# Altium schematic sheet 10.LPDDR4.SchDoc
size A3; SheetNumber: 10; SheetTotal: 10
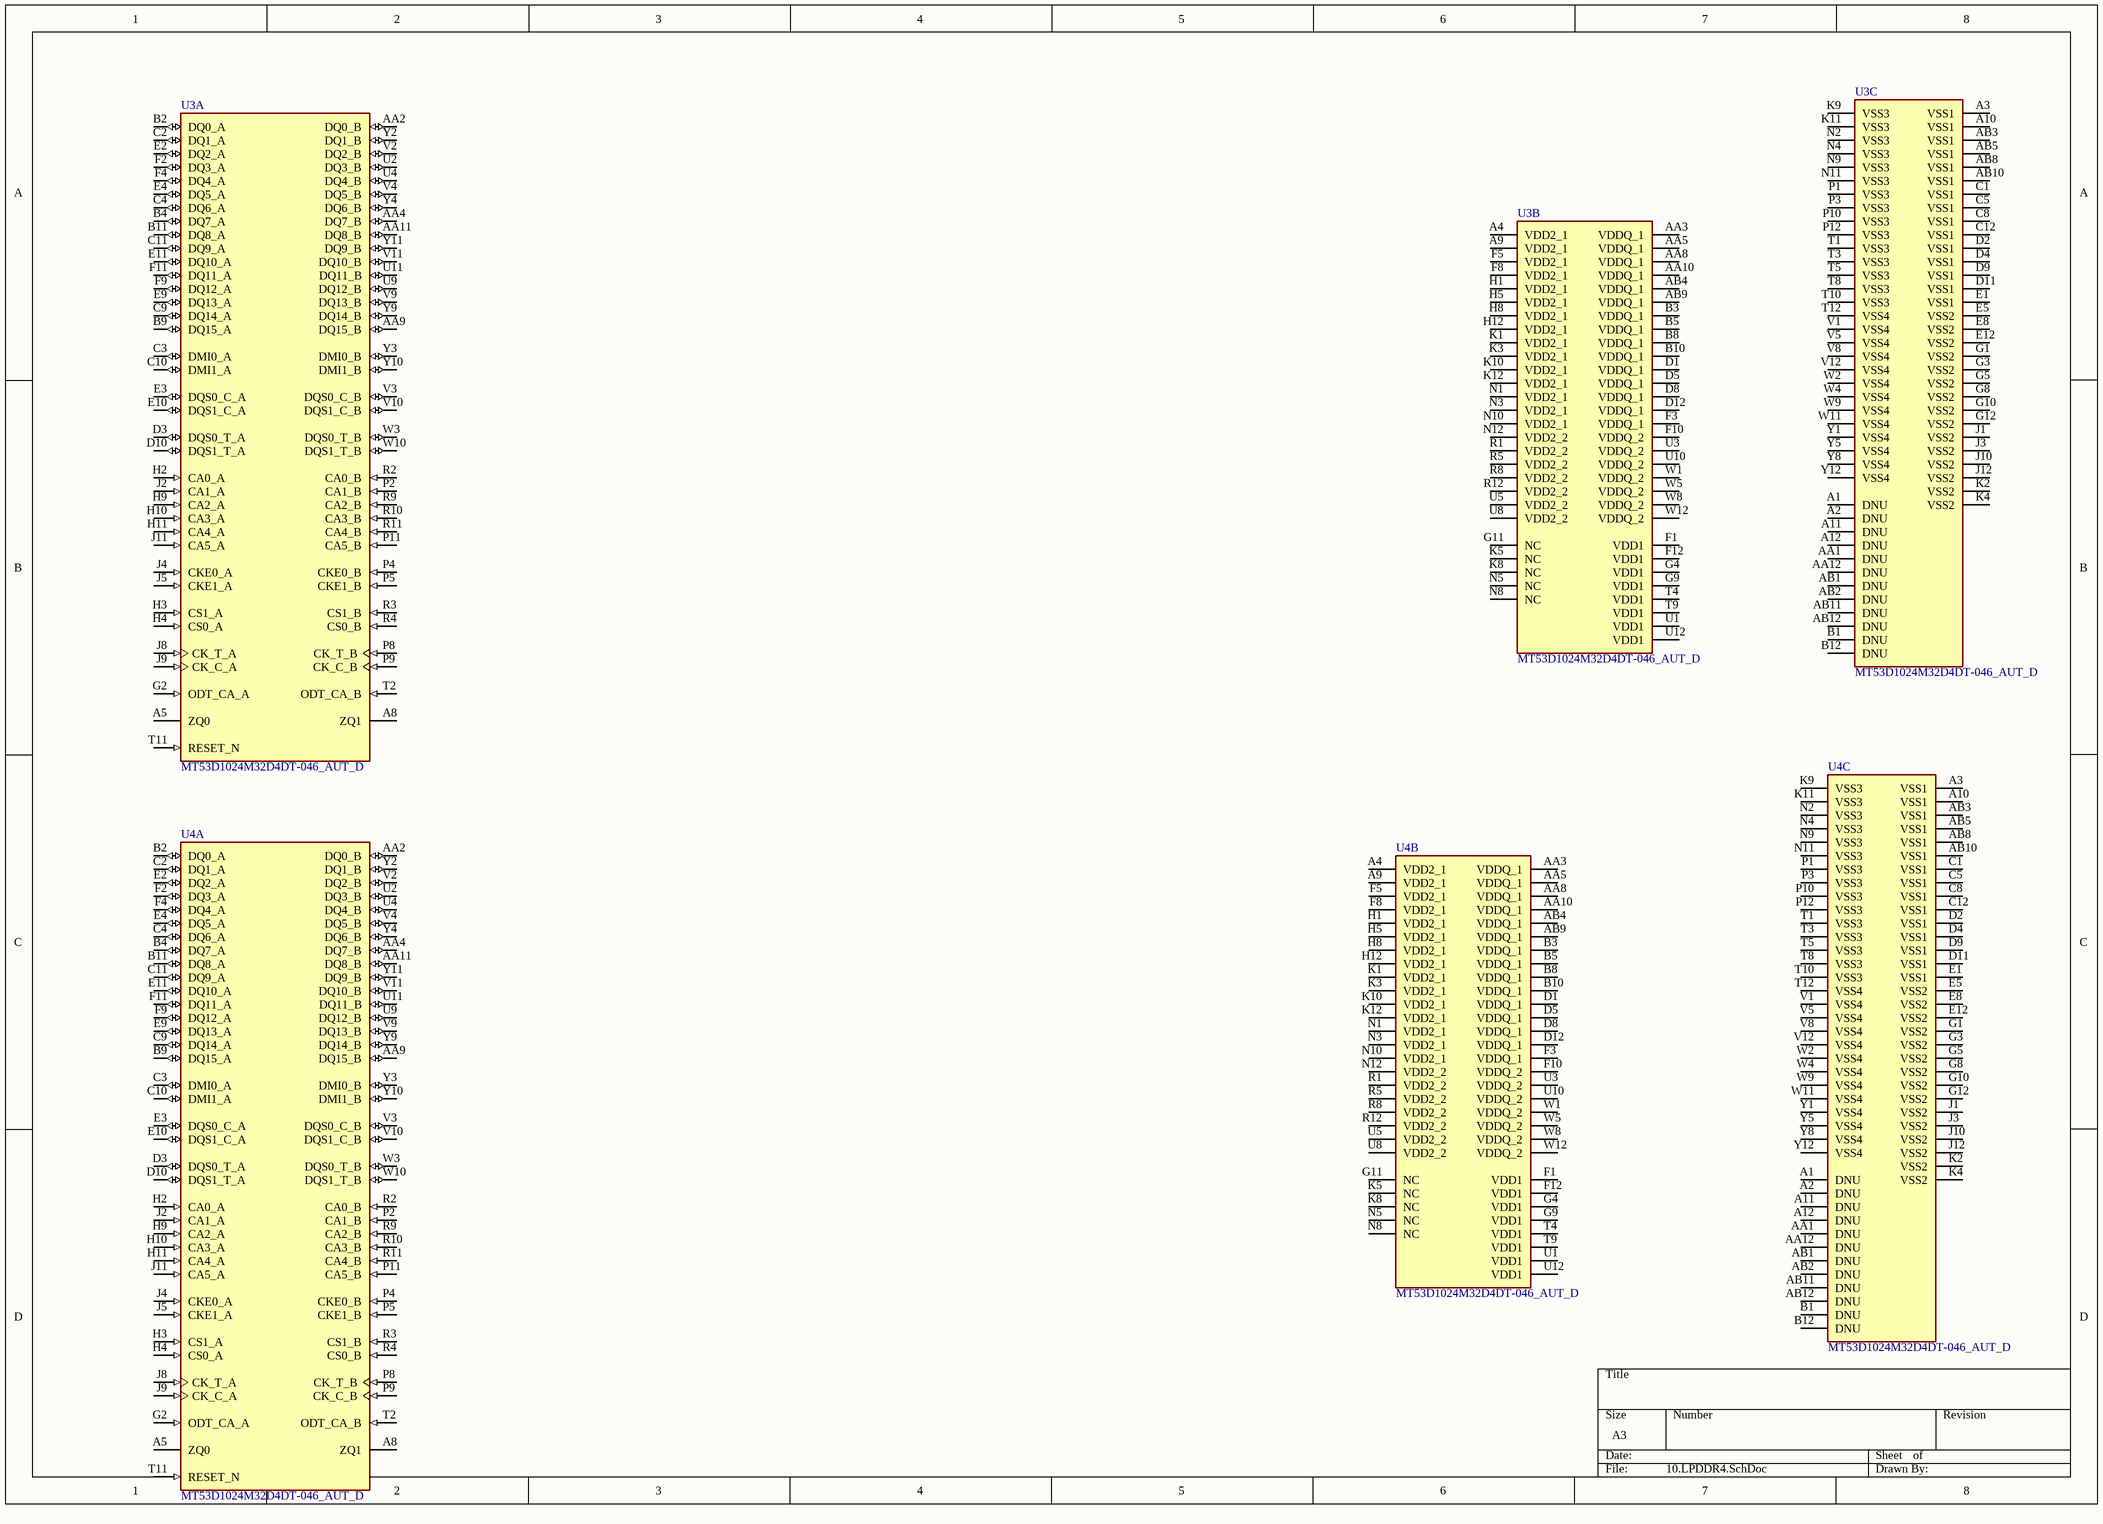
[diagram p0: 10.LPDDR4.SchDoc]

## Parts
U3  MT53D1024M32D4DT-046_AUT_D  [IC_MT53D1024M32D4DT-046_AUT_D]  (parts A,B,C of 3)
U4  MT53D1024M32D4DT-046_AUT_D  [IC_MT53D1024M32D4DT-046_AUT_D]  (parts A,B,C of 3)

## Nets

Not connected (* = marked no-connect by the designer): U3 A1(DNU) A2(DNU) A3(VSS1) A4(VDD2_1) A5(ZQ0) A8(ZQ1) A9(VDD2_1) A10(VSS1) A11(DNU) A12(DNU) AA1(DNU) AA2(DQ0_B) AA3(VDDQ_1) AA4(DQ7_B) AA5(VDDQ_1) AA8(VDDQ_1) AA9(DQ15_B) AA10(VDDQ_1) AA11(DQ8_B) AA12(DNU) AB1(DNU) AB2(DNU) AB3(VSS1) AB4(VDDQ_1) AB5(VSS1) AB8(VSS1) AB9(VDDQ_1) AB10(VSS1) AB11(DNU) AB12(DNU) B1(DNU) B2(DQ0_A) B3(VDDQ_1) B4(DQ7_A) B5(VDDQ_1) B8(VDDQ_1) B9(DQ15_A) B10(VDDQ_1) B11(DQ8_A) B12(DNU) C1(VSS1) C2(DQ1_A) C3(DMI0_A) C4(DQ6_A) C5(VSS1) C8(VSS1) C9(DQ14_A) C10(DMI1_A) C11(DQ9_A) C12(VSS1) D1(VDDQ_1) D2(VSS1) D3(DQS0_T_A) D4(VSS1) D5(VDDQ_1) D8(VDDQ_1) D9(VSS1) D10(DQS1_T_A) D11(VSS1) D12(VDDQ_1) E1(VSS1) E2(DQ2_A) E3(DQS0_C_A) E4(DQ5_A) E5(VSS2) E8(VSS2) E9(DQ13_A) E10(DQS1_C_A) E11(DQ10_A) E12(VSS2) F1(VDD1) F2(DQ3_A) F3(VDDQ_1) F4(DQ4_A) F5(VDD2_1) F8(VDD2_1) F9(DQ12_A) F10(VDDQ_2) F11(DQ11_A) F12(VDD1) G1(VSS2) G2(ODT_CA_A) G3(VSS2) G4(VDD1) G5(VSS2) G8(VSS2) G9(VDD1) G10(VSS2) G11(NC) G12(VSS2) H1(VDD2_1) H2(CA0_A) H3(CS1_A) H4(CS0_A) H5(VDD2_1) H8(VDD2_1) H9(CA2_A) H10(CA3_A) H11(CA4_A) H12(VDD2_1) J1(VSS2) J2(CA1_A) J3(VSS2) J4(CKE0_A) J5(CKE1_A) J8(CK_T_A) J9(CK_C_A) J10(VSS2) J11(CA5_A) J12(VSS2) K1(VDD2_1) K2(VSS2) K3(VDD2_1) K4(VSS2) K5(NC) K8(NC) K9(VSS3) K10(VDD2_1) K11(VSS3) K12(VDD2_1) N1(VDD2_1) N2(VSS3) N3(VDD2_1) N4(VSS3) N5(NC) N8(NC) N9(VSS3) N10(VDD2_1) N11(VSS3) N12(VDD2_2) P1(VSS3) P2(CA1_B) P3(VSS3) P4(CKE0_B) P5(CKE1_B) P8(CK_T_B) P9(CK_C_B) P10(VSS3) P11(CA5_B) P12(VSS3) R1(VDD2_2) R2(CA0_B) R3(CS1_B) R4(CS0_B) R5(VDD2_2) R8(VDD2_2) R9(CA2_B) R10(CA3_B) R11(CA4_B) R12(VDD2_2) T1(VSS3) T2(ODT_CA_B) T3(VSS3) T4(VDD1) T5(VSS3) T8(VSS3) T9(VDD1) T10(VSS3) T11(RESET_N) T12(VSS4) U1(VDD1) U2(DQ3_B) U3(VDDQ_2) U4(DQ4_B) U5(VDD2_2) U8(VDD2_2) U9(DQ12_B) U10(VDDQ_2) U11(DQ11_B) U12(VDD1) V1(VSS4) V2(DQ2_B) V3(DQS0_C_B) V4(DQ5_B) V5(VSS4) V8(VSS4) V9(DQ13_B) V10(DQS1_C_B) V11(DQ10_B) V12(VSS4) W1(VDDQ_2) W2(VSS4) W3(DQS0_T_B) W4(VSS4) W5(VDDQ_2) W8(VDDQ_2) W9(VSS4) W10(DQS1_T_B) W11(VSS4) W12(VDDQ_2) Y1(VSS4) Y2(DQ1_B) Y3(DMI0_B) Y4(DQ6_B) Y5(VSS4) Y8(VSS4) Y9(DQ14_B) Y10(DMI1_B) Y11(DQ9_B) Y12(VSS4); U4 A1(DNU) A2(DNU) A3(VSS1) A4(VDD2_1) A5(ZQ0) A8(ZQ1) A9(VDD2_1) A10(VSS1) A11(DNU) A12(DNU) AA1(DNU) AA2(DQ0_B) AA3(VDDQ_1) AA4(DQ7_B) AA5(VDDQ_1) AA8(VDDQ_1) AA9(DQ15_B) AA10(VDDQ_1) AA11(DQ8_B) AA12(DNU) AB1(DNU) AB2(DNU) AB3(VSS1) AB4(VDDQ_1) AB5(VSS1) AB8(VSS1) AB9(VDDQ_1) AB10(VSS1) AB11(DNU) AB12(DNU) B1(DNU) B2(DQ0_A) B3(VDDQ_1) B4(DQ7_A) B5(VDDQ_1) B8(VDDQ_1) B9(DQ15_A) B10(VDDQ_1) B11(DQ8_A) B12(DNU) C1(VSS1) C2(DQ1_A) C3(DMI0_A) C4(DQ6_A) C5(VSS1) C8(VSS1) C9(DQ14_A) C10(DMI1_A) C11(DQ9_A) C12(VSS1) D1(VDDQ_1) D2(VSS1) D3(DQS0_T_A) D4(VSS1) D5(VDDQ_1) D8(VDDQ_1) D9(VSS1) D10(DQS1_T_A) D11(VSS1) D12(VDDQ_1) E1(VSS1) E2(DQ2_A) E3(DQS0_C_A) E4(DQ5_A) E5(VSS2) E8(VSS2) E9(DQ13_A) E10(DQS1_C_A) E11(DQ10_A) E12(VSS2) F1(VDD1) F2(DQ3_A) F3(VDDQ_1) F4(DQ4_A) F5(VDD2_1) F8(VDD2_1) F9(DQ12_A) F10(VDDQ_2) F11(DQ11_A) F12(VDD1) G1(VSS2) G2(ODT_CA_A) G3(VSS2) G4(VDD1) G5(VSS2) G8(VSS2) G9(VDD1) G10(VSS2) G11(NC) G12(VSS2) H1(VDD2_1) H2(CA0_A) H3(CS1_A) H4(CS0_A) H5(VDD2_1) H8(VDD2_1) H9(CA2_A) H10(CA3_A) H11(CA4_A) H12(VDD2_1) J1(VSS2) J2(CA1_A) J3(VSS2) J4(CKE0_A) J5(CKE1_A) J8(CK_T_A) J9(CK_C_A) J10(VSS2) J11(CA5_A) J12(VSS2) K1(VDD2_1) K2(VSS2) K3(VDD2_1) K4(VSS2) K5(NC) K8(NC) K9(VSS3) K10(VDD2_1) K11(VSS3) K12(VDD2_1) N1(VDD2_1) N2(VSS3) N3(VDD2_1) N4(VSS3) N5(NC) N8(NC) N9(VSS3) N10(VDD2_1) N11(VSS3) N12(VDD2_2) P1(VSS3) P2(CA1_B) P3(VSS3) P4(CKE0_B) P5(CKE1_B) P8(CK_T_B) P9(CK_C_B) P10(VSS3) P11(CA5_B) P12(VSS3) R1(VDD2_2) R2(CA0_B) R3(CS1_B) R4(CS0_B) R5(VDD2_2) R8(VDD2_2) R9(CA2_B) R10(CA3_B) R11(CA4_B) R12(VDD2_2) T1(VSS3) T2(ODT_CA_B) T3(VSS3) T4(VDD1) T5(VSS3) T8(VSS3) T9(VDD1) T10(VSS3) T11(RESET_N) T12(VSS4) U1(VDD1) U2(DQ3_B) U3(VDDQ_2) U4(DQ4_B) U5(VDD2_2) U8(VDD2_2) U9(DQ12_B) U10(VDDQ_2) U11(DQ11_B) U12(VDD1) V1(VSS4) V2(DQ2_B) V3(DQS0_C_B) V4(DQ5_B) V5(VSS4) V8(VSS4) V9(DQ13_B) V10(DQS1_C_B) V11(DQ10_B) V12(VSS4) W1(VDDQ_2) W2(VSS4) W3(DQS0_T_B) W4(VSS4) W5(VDDQ_2) W8(VDDQ_2) W9(VSS4) W10(DQS1_T_B) W11(VSS4) W12(VDDQ_2) Y1(VSS4) Y2(DQ1_B) Y3(DMI0_B) Y4(DQ6_B) Y5(VSS4) Y8(VSS4) Y9(DQ14_B) Y10(DMI1_B) Y11(DQ9_B) Y12(VSS4)

## Library data of the parts
U3 U4 = MT53D1024M32D4DT-046_AUT_D: Package: None; Value: *; MP: MT53D1024M32D4DT-046_AUT_D; Availability: Unavailable; Price: None